# Altium project terminate-logic.PrjPCB
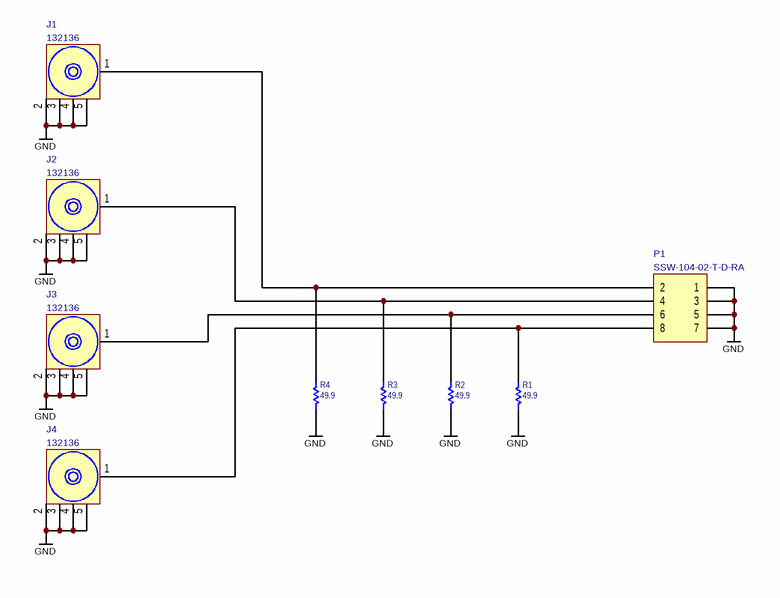
[diagram p0: main.SchDoc]
QualityByDate: N/A; QualityBy: N/A; ManagerDate: N/A; Manager: N/A; EngineerDate: 7/12/2019; Engineer: J. Brinton; CheckedByDate: N/A; CheckedBy: N/A; DrawnByDate: 7/12/2019; DrawnBy: J. Brinton; PartNumber: N/A; Revision: 1; Release: 1; CompanyEmail: support@amaya.tech; CompanyAddress: California, USA; Company: Amaya Tech; ClientProject: Terminate Logic; ClientAddress: California, USA; Client: Amaya Tech
1 sheet, 9 parts. Net scope: global (net labels, ports and power ports of the same name join across sheets).
Board file: terminate-logic.PcbDoc

## Sheet main.SchDoc: Top Sheet
size Letter; DrawnBy: J. Brinton; Engineer: J. Brinton; Revision: 1; SheetNumber: 1; SheetTotal: 1

### Parts
J1  132136  [132136]
J2  132136  [132136]
J3  132136  [132136]
J4  132136  [132136]
P1  SSW-104-02-T-D-RA  [SSW-104-02-T-D-RA]
R1  value 49.9  [RESC2012X70N]  (hidden comment: ERJ-6ENF49R9V)
R2  value 49.9  [RESC2012X70N]  (hidden comment: ERJ-6ENF49R9V)
R3  value 49.9  [RESC2012X70N]  (hidden comment: ERJ-6ENF49R9V)
R4  value 49.9  [RESC2012X70N]  (hidden comment: ERJ-6ENF49R9V)

### Nets
GND: J1.2(GND) J1.3(GND) J1.4(GND) J1.5(GND) J2.2(GND) J2.3(GND) J2.4(GND) J2.5(GND) J3.2(GND) J3.3(GND) J3.4(GND) J3.5(GND) J4.2(GND) J4.3(GND) J4.4(GND) J4.5(GND) P1.1 P1.3 P1.5 P1.7 R1.2 R2.2 R3.2 R4.2
NetJ1_1: J1.1(CENTER) P1.2 R4.1
NetJ2_1: J2.1(CENTER) P1.4 R3.1
NetJ3_1: J3.1(CENTER) P1.6 R2.1
NetJ4_1: J4.1(CENTER) P1.8 R1.1

### Notes on the sheet
- Designed By:
- Title
- Engineer
- Revision
- Drawn By
- Date
- Sheet
- of

### Library data of the parts
J1-J4 = 132136: SMA Right Angle Connector COAX Female; Manufacturer: Amphenol; Manufacturer P/N: 132136
P1 = SSW-104-02-T-D-RA: Through Hole Right Angle 0.1"-Pitch Header Receptacle; Manufacturer: Samtec; Manufacturer P/N: SSW-104-02-T-D-RA
R1-R4 = RES 0402: Thick Film Resistor 49.9 ±1% 0805; Manufacturer: Panasonic; Tr: -55:155; Alternate: any same value component; Package: 0805; Manufacturer P/N: ERJ-6ENF49R9V; Tolerance: ±1%